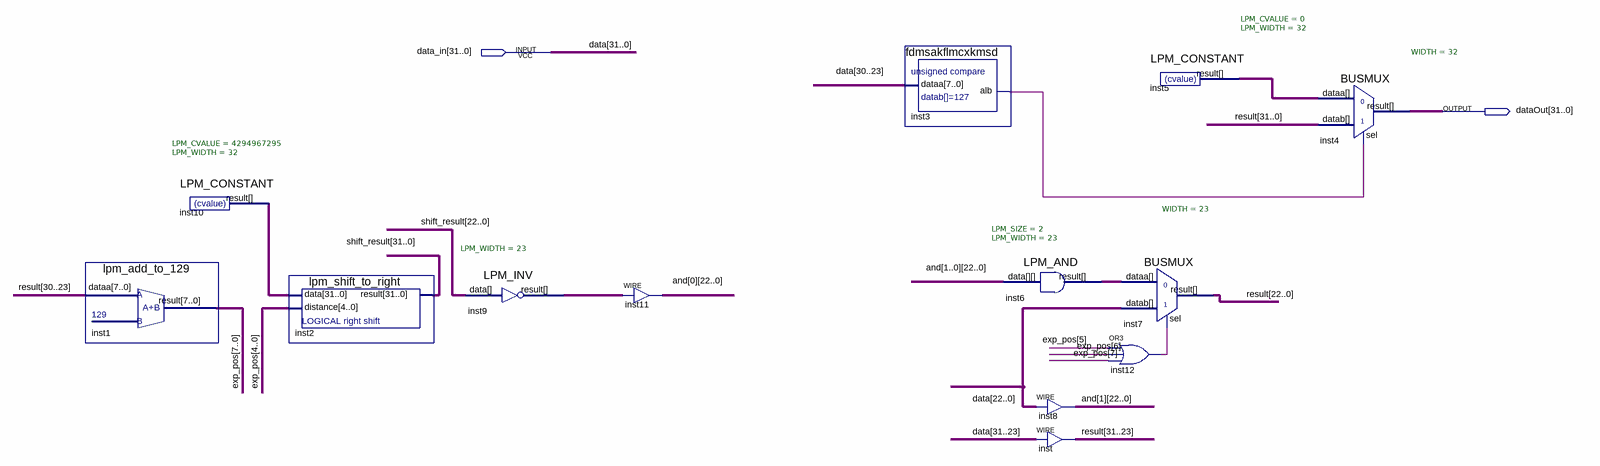
[diagram p0: schematic sheet]
// Quartus schematic Block2.bdf as structural Verilog: 13 symbols, 2 pins
module Block2 (
  input  [31:0] data_in,
  output [31:0] dataOut
);

  wire inst3_alb, inst12_out;
  wire [7:0] exp_pos;
  wire [22:0] and_0, and_1, inst6_result, inst9_result;
  wire [31:0] inst5_result, inst10_result, result, shift_result;

  lpm_add_to_129 inst1 (.dataa(result[30:23]), .result(exp_pos));
  LPM_CONSTANT #(.LPM_CVALUE(4294967295), .LPM_WIDTH(32)) inst10 (.result(inst10_result));
  lpm_shift_to_right inst2 (.data(inst10_result), .distance(exp_pos[4:0]), .result(shift_result));
  LPM_INV #(.LPM_WIDTH(23)) inst9 (.data(shift_result[22:0]), .result(inst9_result));
  assign and_0 = inst9_result;  // WIRE inst11
  fdmsakflmcxkmsd inst3 (.dataa(data_in[30:23]), .alb(inst3_alb));
  LPM_AND #(.LPM_SIZE(2), .LPM_WIDTH(23)) inst6 (.data({and_1, and_0}), .result(inst6_result));
  assign and_1 = data_in[22:0];  // WIRE inst8
  assign result[31:23] = data_in[31:23];  // WIRE inst
  LPM_CONSTANT #(.LPM_CVALUE(0), .LPM_WIDTH(32)) inst5 (.result(inst5_result));
  BUSMUX #(.WIDTH(23)) inst7 (.datab(data_in[22:0]), .sel(inst12_out), .dataa(inst6_result), .result(result[22:0]));
  or inst12 (inst12_out, exp_pos[5], exp_pos[6], exp_pos[7]);
  BUSMUX #(.WIDTH(32)) inst4 (.datab(result), .sel(inst3_alb), .dataa(inst5_result), .result(dataOut));

  // Other names for the same wires on the sheet: data[31:0] = data_in
endmodule
